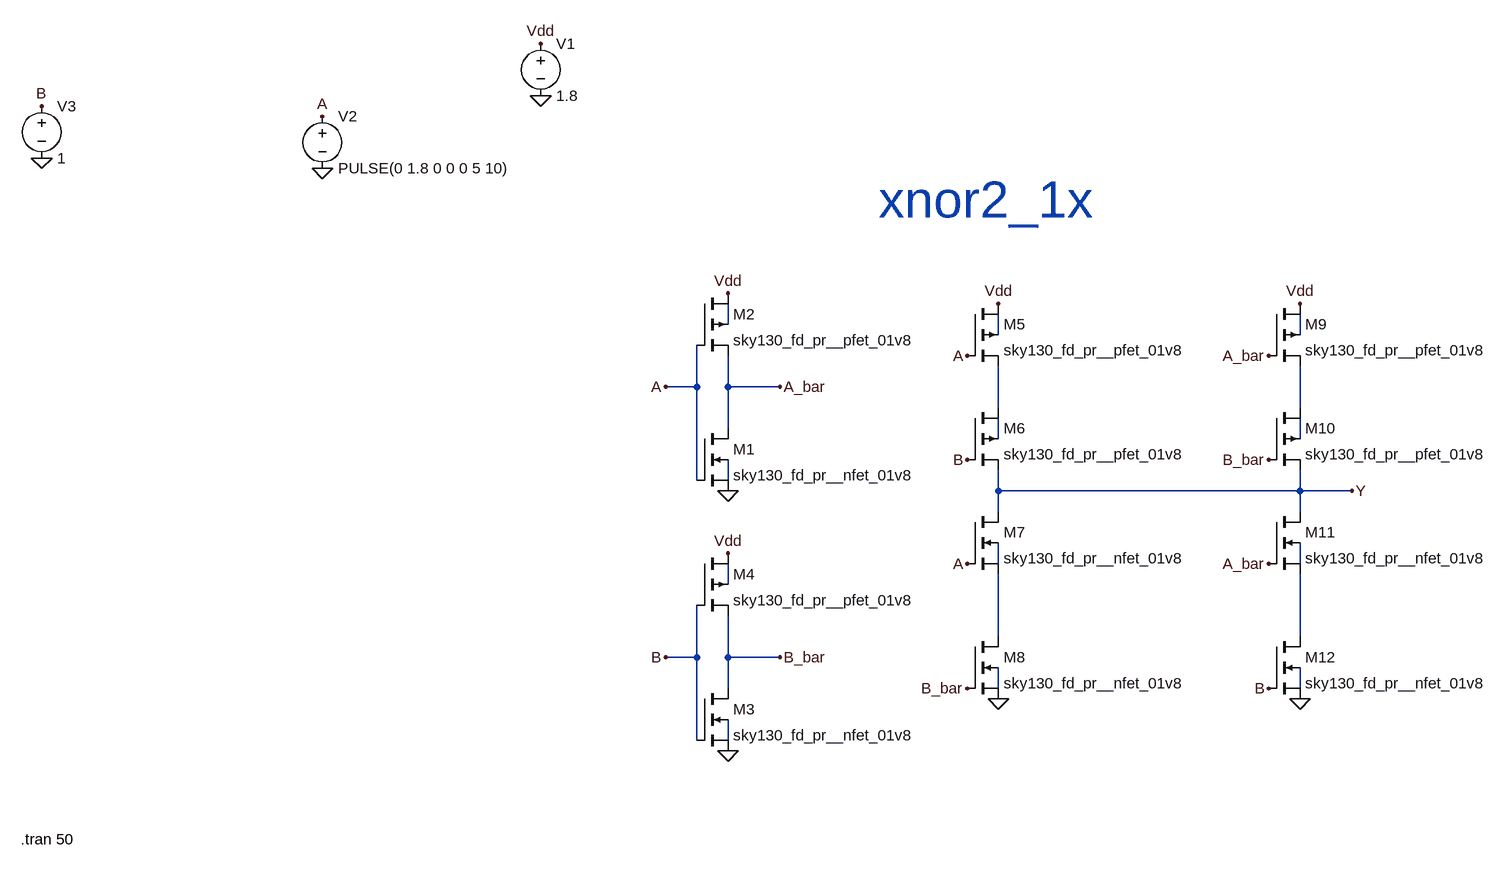
[diagram p0: schematic xnor2_1x.asc]
xnor2_1x.asc, the LTspice schematic file:
Version 4
SHEET 1 1808 984
WIRE 608 176 608 144
WIRE 1024 192 1024 160
WIRE 1488 192 1488 160
WIRE 560 272 560 208
WIRE 560 272 512 272
WIRE 608 272 608 224
WIRE 688 272 608 272
WIRE 1024 304 1024 240
WIRE 1488 304 1488 240
WIRE 608 336 608 272
WIRE 1024 352 1024 320
WIRE 1488 352 1488 320
WIRE 560 416 560 272
WIRE 608 416 608 384
WIRE 1024 432 1024 400
WIRE 1488 432 1488 400
WIRE 1488 432 1024 432
WIRE 1568 432 1488 432
WIRE 1024 464 1024 432
WIRE 1488 464 1488 432
WIRE 1024 544 1024 512
WIRE 1488 544 1488 512
WIRE 608 576 608 544
WIRE 1024 656 1024 560
WIRE 1488 656 1488 560
WIRE 560 688 560 608
WIRE 560 688 512 688
WIRE 608 688 608 624
WIRE 688 688 608 688
WIRE 608 736 608 688
WIRE 1024 736 1024 704
WIRE 1488 736 1488 704
WIRE 560 816 560 688
WIRE 608 816 608 784
FLAG 320 -256 Vdd
FLAG 320 -176 0
FLAG -16 -144 A
FLAG -16 -64 0
FLAG -448 -160 B
FLAG -448 -80 0
FLAG 608 432 0
FLAG 608 128 Vdd
FLAG 688 272 A_bar
FLAG 512 272 A
FLAG 608 832 0
FLAG 608 528 Vdd
FLAG 512 688 B
FLAG 688 688 B_bar
FLAG 1024 144 Vdd
FLAG 1024 752 0
FLAG 1488 144 Vdd
FLAG 1488 752 0
FLAG 1568 432 Y
FLAG 976 224 A
FLAG 1440 224 A_bar
FLAG 1440 544 A_bar
FLAG 976 544 A
FLAG 976 736 B_bar
FLAG 976 384 B
FLAG 1440 736 B
FLAG 1440 384 B_bar
SYMBOL voltage 320 -272 R0
WINDOW 123 0 0 Left 0
WINDOW 39 0 0 Left 0
SYMATTR InstName V1
SYMATTR Value 1.8
SYMBOL voltage -16 -160 R0
WINDOW 123 0 0 Left 0
WINDOW 39 0 0 Left 0
SYMATTR InstName V2
SYMATTR Value PULSE(0 1.8 0 0 0 5 10)
SYMBOL voltage -448 -176 R0
WINDOW 123 0 0 Left 0
WINDOW 39 0 0 Left 0
SYMATTR InstName V3
SYMATTR Value 1
SYMBOL nmos4 560 336 R0
SYMATTR InstName M1
SYMATTR Value2 l=0.13u w=0.13u
SYMATTR Value sky130_fd_pr__nfet_01v8
SYMBOL pmos4 560 128 R0
SYMATTR InstName M2
SYMATTR Value2 l=0.13u w=0.13u
SYMATTR Value sky130_fd_pr__pfet_01v8
SYMBOL nmos4 560 736 R0
SYMATTR InstName M3
SYMATTR Value2 l=0.13u w=0.13u
SYMATTR Value sky130_fd_pr__nfet_01v8
SYMBOL pmos4 560 528 R0
SYMATTR InstName M4
SYMATTR Value2 l=0.13u w=0.13u
SYMATTR Value sky130_fd_pr__pfet_01v8
SYMBOL pmos4 976 144 R0
SYMATTR InstName M5
SYMATTR Value2 l=0.13u w=0.13u
SYMATTR Value sky130_fd_pr__pfet_01v8
SYMBOL pmos4 976 304 R0
SYMATTR InstName M6
SYMATTR Value2 l=0.13u w=0.13u
SYMATTR Value sky130_fd_pr__pfet_01v8
SYMBOL nmos4 976 464 R0
SYMATTR InstName M7
SYMATTR Value2 l=0.13u w=0.13u
SYMATTR Value sky130_fd_pr__nfet_01v8
SYMBOL nmos4 976 656 R0
SYMATTR InstName M8
SYMATTR Value2 l=0.13u w=0.13u
SYMATTR Value sky130_fd_pr__nfet_01v8
SYMBOL pmos4 1440 144 R0
SYMATTR InstName M9
SYMATTR Value2 l=0.13u w=0.13u
SYMATTR Value sky130_fd_pr__pfet_01v8
SYMBOL pmos4 1440 304 R0
SYMATTR InstName M10
SYMATTR Value2 l=0.13u w=0.13u
SYMATTR Value sky130_fd_pr__pfet_01v8
SYMBOL nmos4 1440 464 R0
SYMATTR InstName M11
SYMATTR Value2 l=0.13u w=0.13u
SYMATTR Value sky130_fd_pr__nfet_01v8
SYMBOL nmos4 1440 656 R0
SYMATTR InstName M12
SYMATTR Value2 l=0.13u w=0.13u
SYMATTR Value sky130_fd_pr__nfet_01v8
TEXT -480 968 Left 2 !.tran 50
TEXT 840 -16 Left 6 ;xnor2_1x

The netlist it stands for:
* xnor2_1x.asc
V1 Vdd 0 1.8
V2 A 0 PULSE(0 1.8 0 0 0 5 10)
V3 B 0 1
M1 A_bar A 0 N008 sky130_fd_pr__nfet_01v8 l=0.13u w=0.13u
M2 Vdd A A_bar N001 sky130_fd_pr__pfet_01v8 l=0.13u w=0.13u
M3 B_bar B 0 N016 sky130_fd_pr__nfet_01v8 l=0.13u w=0.13u
M4 Vdd B B_bar N011 sky130_fd_pr__pfet_01v8 l=0.13u w=0.13u
M5 Vdd A N004 N002 sky130_fd_pr__pfet_01v8 l=0.13u w=0.13u
M6 N004 B Y N006 sky130_fd_pr__pfet_01v8 l=0.13u w=0.13u
M7 Y A N012 N009 sky130_fd_pr__nfet_01v8 l=0.13u w=0.13u
M8 N012 B_bar 0 N014 sky130_fd_pr__nfet_01v8 l=0.13u w=0.13u
M9 Vdd A_bar N005 N003 sky130_fd_pr__pfet_01v8 l=0.13u w=0.13u
M10 N005 B_bar Y N007 sky130_fd_pr__pfet_01v8 l=0.13u w=0.13u
M11 Y A_bar N013 N010 sky130_fd_pr__nfet_01v8 l=0.13u w=0.13u
M12 N013 B 0 N015 sky130_fd_pr__nfet_01v8 l=0.13u w=0.13u
.model NMOS NMOS
.model PMOS PMOS
.lib standard.mos
.tran 50
* xnor2_1x
.backanno
.end